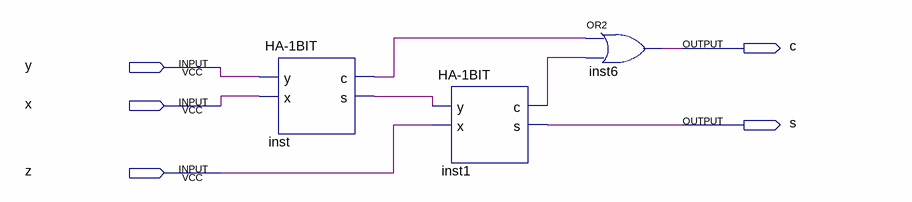
[diagram p0: schematic sheet]
// Quartus schematic FA-1BIT.bdf as structural Verilog: 3 symbols, 5 pins
module \FA-1BIT  (
  input  y,
  input  x,
  input  z,
  output c,
  output s
);

  wire inst1_c, inst_c, inst_s;

  \HA-1BIT  inst (.y(y), .x(x), .c(inst_c), .s(inst_s));
  \HA-1BIT  inst1 (.y(inst_s), .x(z), .c(inst1_c), .s(s));
  or inst6 (c, inst_c, inst1_c);
endmodule
